# EAGLE design Group_04 (EAGLE 9.6.2)
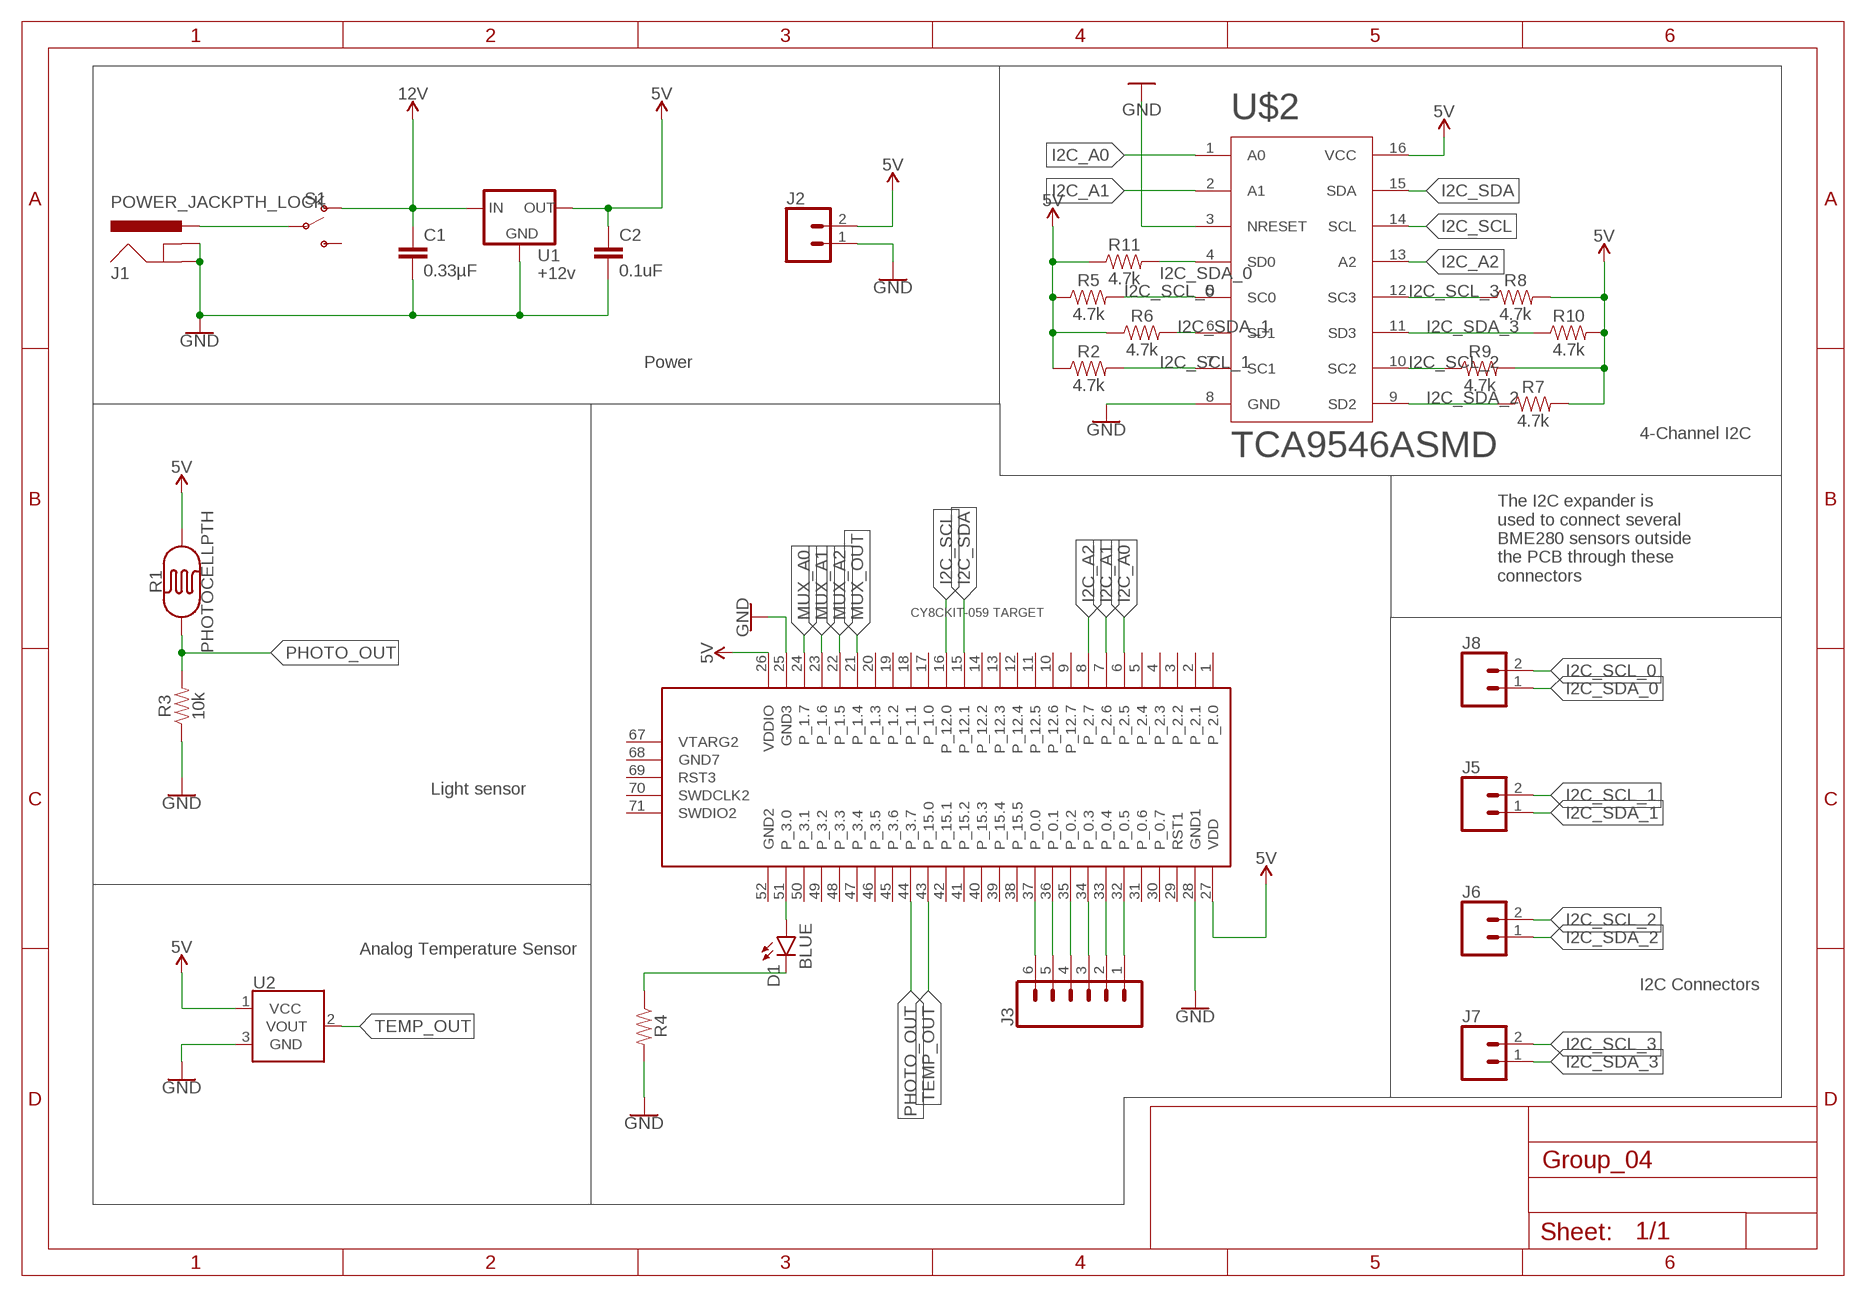
[diagram p0: schematic, sheet 1, part 1 of 2]
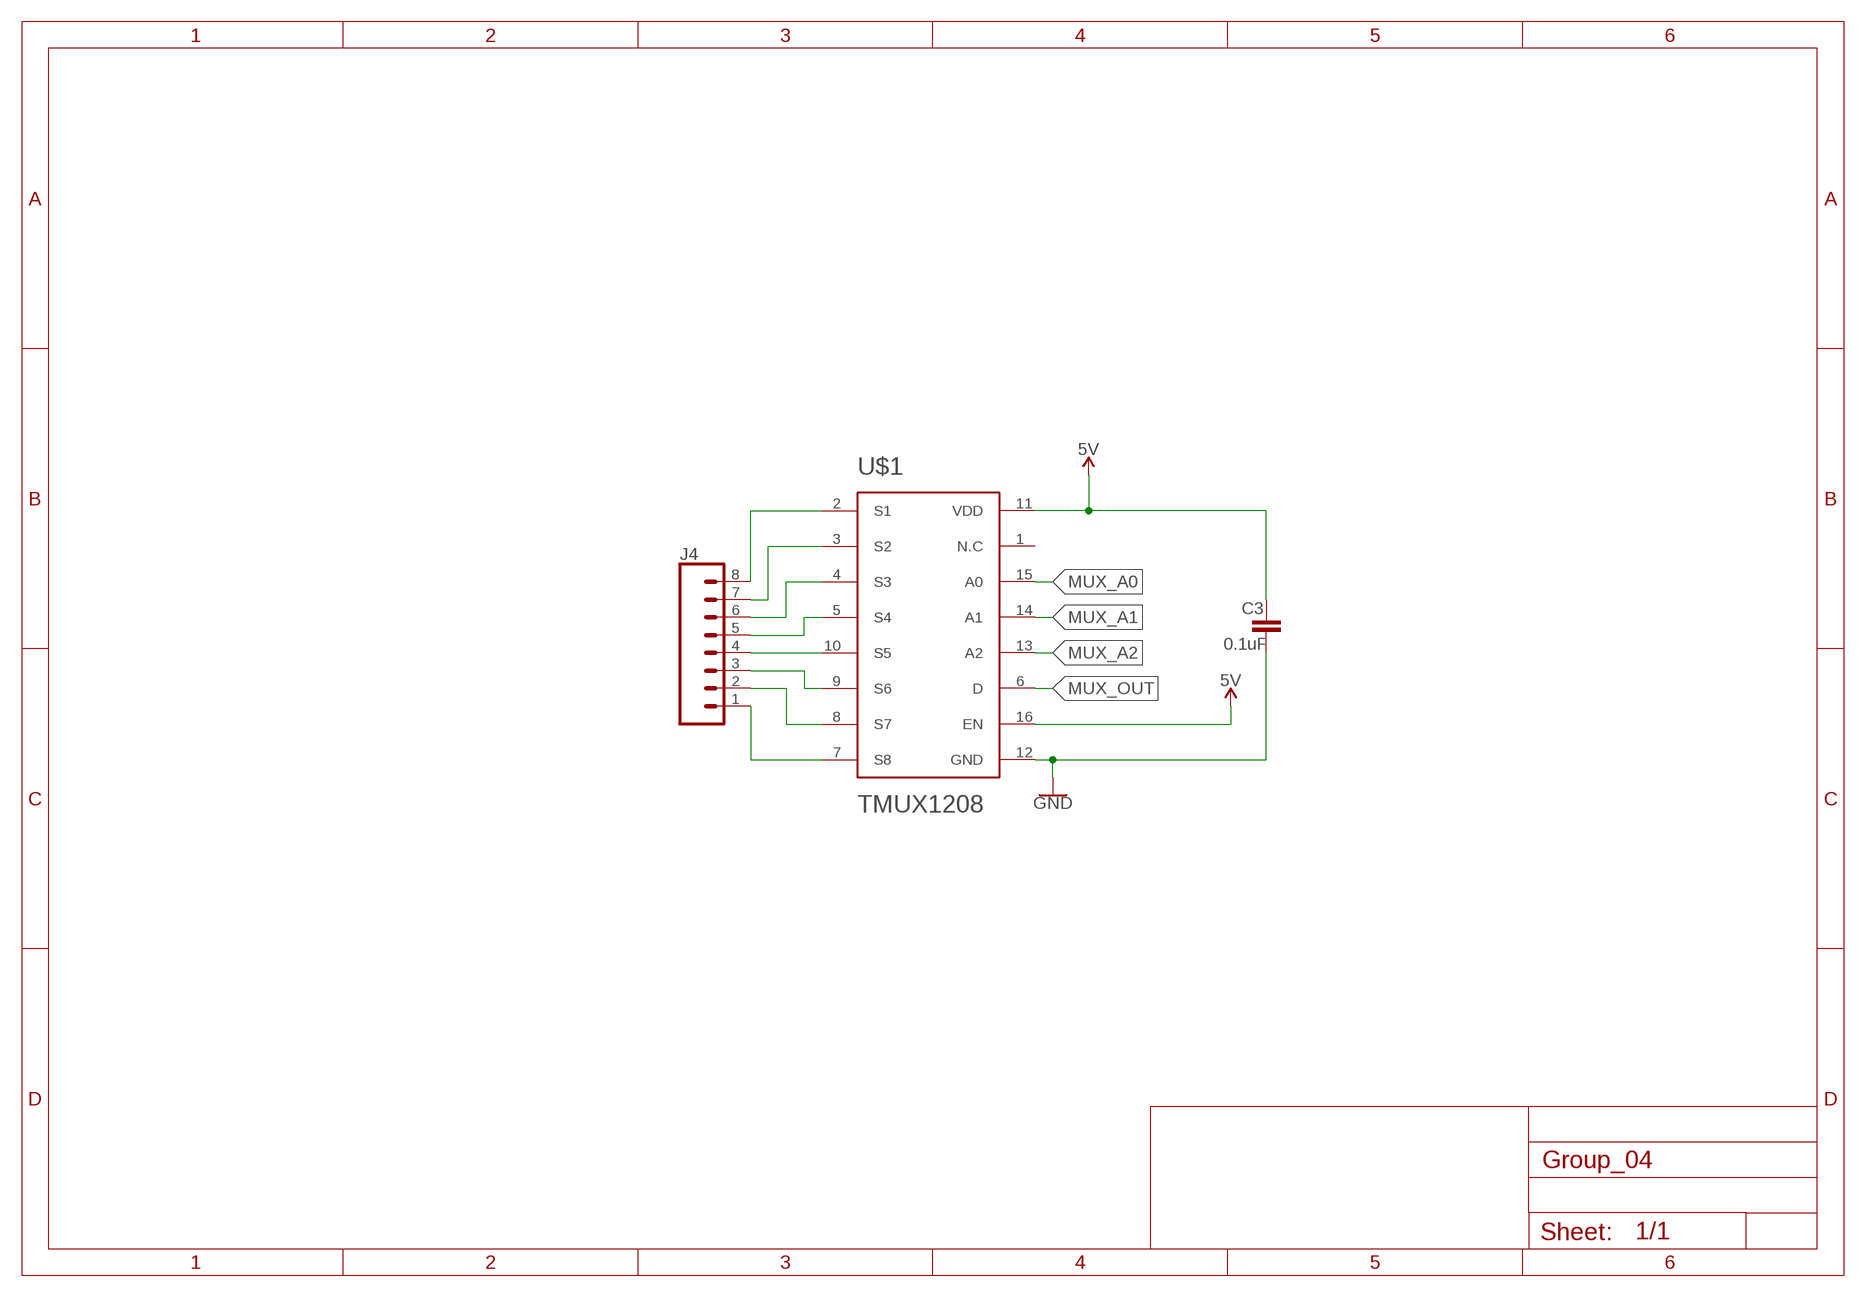
[diagram p1: schematic, sheet 1, part 2 of 2]

## Parts
C1  0.33µF  0.33UF/330NF-0805-50V-10%  [0805]
C2  0.1uF  0.1UF-KIT-EZ-50V-20%  [CAP-PTH-SMALL-KIT]
C3  0.1uF  0.1UF-KIT-EZ-50V-20%  [CAP-PTH-SMALL-KIT]
D1  BLUE  LED-BLUE1206  [LED-1206]
J1  POWER_JACKPTH_LOCK  [POWER_JACK_PTH_LOCK]
J2  CONN_02  [1X02]
J3  CONN_06LOCK  [1X06_LOCK]
J4  CONN_08LOCK  [1X08_LOCK]
J5  CONN_02  [1X02]
J6  CONN_02  [1X02]
J7  CONN_02  [1X02]
J8  CONN_02  [1X02]
R1  PHOTOCELLPTH  [PHOTOCELL]
R2  4.7k  4.7KOHM-0603-1/10W-1%  [0603]
R3  10k  10KOHM-0603-1/10W-1%  [0603]
R4  RESISTORAXIAL-0.3  [AXIAL-0.3]
R5  4.7k  4.7KOHM-0603-1/10W-1%  [0603]
R6  4.7k  4.7KOHM-0603-1/10W-1%  [0603]
R7  4.7k  4.7KOHM-0603-1/10W-1%  [0603]
R8  4.7k  4.7KOHM-0603-1/10W-1%  [0603]
R9  4.7k  4.7KOHM-0603-1/10W-1%  [0603]
R10  4.7k  4.7KOHM-0603-1/10W-1%  [0603]
R11  4.7k  4.7KOHM-0603-1/10W-1%  [0603]
S1  SWITCH-SPDT-PTH-11.6X4.0MM  [SWITCH_SPDT_PTH_11.6X4.0MM]
U1  +12v  V_REG_78XX7812  [TO-252]
U2  TMP36GT9  [TO-92]
U$1  TMUX1208  [QFN-16]
U$2  TCA9546ASMD  [TSSOP-16]
U$3  CY8CKIT-059_TARGET  [CY8CKIT-059_TARGET]

## Nets
5V: C2.1 C3.1 J2.2 R1.2 R2.1 R5.1 R6.1 R7.2 R8.2 R9.2 R10.2 R11.1 U1.2(OUT) U2.1(VCC) U$1.11(VDD) U$1.16(EN) U$2.16(VCC) U$3.26(VDDIO) U$3.27(VDD)
12V: C1.1 S1.1(O) U1.1(IN)
GND: C1.2 C2.2 C3.2 J1.GND J1.GNDBREAK J2.1 R3.1 R4.P$2 U1.3(GND) U2.3(GND) U$1.12(GND) U$2.3(NRESET) U$2.8(GND) U$3.25(GND3) U$3.28(GND1)
I2C_A0: U$2.1(A0) U$3.6(P_2.5)
I2C_A1: U$2.2(A1) U$3.7(P_2.6)
I2C_A2: U$2.13(A2) U$3.8(P_2.7)
I2C_SCL: U$2.14(SCL) U$3.16(P_12.0)
I2C_SCL_0: J8.2 R5.2 U$2.5(SC0)
I2C_SCL_1: J5.2 R2.2 U$2.7(SC1)
I2C_SCL_2: J6.2 R9.1 U$2.10(SC2)
I2C_SCL_3: J7.2 R8.1 U$2.12(SC3)
I2C_SDA: U$2.15(SDA) U$3.15(P_12.1)
I2C_SDA_0: J8.1 R11.2 U$2.4(SD0)
I2C_SDA_1: J5.1 R6.2 U$2.6(SD1)
I2C_SDA_2: J6.1 R7.1 U$2.9(SD2)
I2C_SDA_3: J7.1 R10.1 U$2.11(SD3)
MUX_A0: U$1.15(A0) U$3.24(P_1.7)
MUX_A1: U$1.14(A1) U$3.23(P_1.6)
MUX_A2: U$1.13(A2) U$3.22(P_1.5)
MUX_OUT: U$1.6(D) U$3.21(P_1.4)
N$1: J1.PWR S1.2(P)
N$5: J4.4 U$1.10(S5)
N$10: J4.8 U$1.2(S1)
N$11: J4.7 U$1.3(S2)
N$12: J4.6 U$1.4(S3)
N$13: J4.5 U$1.5(S4)
N$15: J4.3 U$1.9(S6)
N$16: J4.2 U$1.8(S7)
N$17: J4.1 U$1.7(S8)
N$18: D1.C R4.P$1
N$19: D1.A U$3.51(P_3.0)
N$20: J3.6 U$3.37(P_0.0)
N$21: J3.5 U$3.36(P_0.1)
N$22: J3.4 U$3.35(P_0.2)
N$23: J3.3 U$3.34(P_0.3)
N$24: J3.2 U$3.33(P_0.4)
N$25: J3.1 U$3.32(P_0.5)
PHOTO_OUT: R1.1 R3.2 U$3.44(P_3.7)
TEMP_OUT: U2.2(VOUT) U$3.43(P_15.0)
Unconnected: S1.3(S) U$1.1(N.C) U$3.1(P_2.0) U$3.2(P_2.1) U$3.3(P_2.2) U$3.4(P_2.3) U$3.5(P_2.4) U$3.9(P_12.7) U$3.10(P_12.6) U$3.11(P_12.5) U$3.12(P_12.4) U$3.13(P_12.3) U$3.14(P_12.2) U$3.17(P_1.0) U$3.18(P_1.1) U$3.19(P_1.2) U$3.20(P_1.3) U$3.29(RST1) U$3.30(P_0.7) U$3.31(P_0.6) U$3.38(P_15.5) U$3.39(P_15.4) U$3.40(P_15.3) U$3.41(P_15.2) U$3.42(P_15.1) U$3.45(P_3.6) U$3.46(P_3.5) U$3.47(P_3.4) U$3.48(P_3.3) U$3.49(P_3.2) U$3.50(P_3.1) U$3.52(GND2) U$3.67(VTARG2) U$3.68(GND7) U$3.69(RST3) U$3.70(SWDCLK2) U$3.71(SWDIO2)

## Notes on the sheet
- Power
- 4-Channel I2C
- The I2C expander is 
  used to connect several 
  BME280 sensors outside 
  the PCB through these 
  connectors
- Light sensor
- Analog Temperature Sensor
- I2C Connectors

## Library data of the parts
C1 = SparkFun-Capacitors:0.33UF/330NF: 0.33µF/330nF ceramic capacitors A capacitor is a passive two-terminal electrical component used to store electrical energy temporarily in an electric field.; PROD_ID: CAP-08469
C2 C3 = SparkFun-Capacitors:0.1UF: 0.1µF ceramic capacitors A capacitor is a passive two-terminal electrical component used to store electrical energy temporarily in an electric field.; PROD_ID: CAP-08370
D1 = SparkFun-LED:LED-BLUE: Blue SMD LED Used in manufacturing of various products at SparkFun Packages: 0603 - SMD 0603 package [Product Link] <http://www.digikey.com/product-detail/en/SMLE12BC7TT86/511-1589-2-ND/1641808> 1206 - SMD1206 package [Product Link] <http://www.digikey.com/product-detail/en/lite-on-inc/LTST-C150TBKT/160-1643-1-ND/573584> SparkFun Products: ESP8266 Thing-Dev Board <https://www.sparkfun.com/products/13711> RedBoard <https://www.sparkfun.com/products/12757>; PROD_ID: DIO-09911
J1 = SparkFun-Connectors:POWER_JACK: Power Jack Connector This is the standard 5.5mm barrel jack for power. The PTH is the most common, proven, reliable, footprint. The Slot footprint only works if the mill layer is transmitted to the PCB fab house so be warned. Here are the connectors we sell at SparkFun: DC Barrel Power Jack/Connector <https://www.sparkfun.com/products/119> (PRT-00119) DC Barrel Power Jack/Connector (SMD) <https://www.sparkfun.com/products/12748> (PRT-12748) DC Barrel Jack Adapter - Breadboard Compatible <https://www.sparkfun.com/products/10811> (PRT-10811) It is used on this SparkFun product (and many, many others): SparkFun RedBoard - Programmed with Arduino <https://www.sparkfun.com/products/12757> (DEV-12757) Also, if you need a mating power supply or connector, please check these out: Wall Adapter Power Supply - 9VDC 650mA <https://www.sparkfun.com/products/298> (TOL-00298) DC Barrel Jack Adapter - Male <https://www.sparkfun.com/products/10287> (PRT-10287); PROD_ID: CONN-08197; SF_ID: PRT-00119
J2 J5-J8 = SparkFun-Connectors:CONN_02: Multi connection point. Often used as Generic Header-pin footprint for 0.1 inch spaced/style header connections On any of the 0.1 inch spaced packages, you can populate with these: Break Away Headers - Straight <https://www.sparkfun.com/products/116> (PRT-00116) Break Away Male Headers - Right Angle <https://www.sparkfun.com/products/553> (PRT-00553) Female Headers <https://www.sparkfun.com/products/115> (PRT-00115) Break Away Headers - Machine Pin <https://www.sparkfun.com/products/117> (PRT-00117) Break Away Female Headers - Swiss Machine Pin <https://www.sparkfun.com/products/743> (PRT-00743) For SCREWTERMINALS and SPRING TERMINALS visit here: Screw Terimnals on SparkFun.com <https://www.sparkfun.com/search/results?term=Screw+Terminals> (5mm/3.5mm/2.54mm spacing) This device is also useful as a general connection point to wire up your design to another part of your project. Our various solder wires solder well into these plated through hole pads. Hook-Up Wire - Assortment (Stranded, 22 AWG) <https://www.sparkfun.com/products/11375> (PRT-11375) Hook-Up Wire - Assortment (Solid Core, 22 AWG) <https://www.sparkfun.com/products/11367> (PRT-11367) View the entire wire category on our website here <https://www.sparkfun.com/categories/141> Special notes: Molex polarized connector foot print use with: PRT-08233 with associated crimp pins and housings. 2.54_SCREWTERM for use with PRT-10571. 3.5mm Screw Terminal footprints for PRT-08084 5mm Screw Terminal footprints for use with PRT-08432
J3 = SparkFun-Connectors:CONN_06: Multi connection point. Often used as Generic Header-pin footprint for 0.1 inch spaced/style header connections On any of the 0.1 inch spaced packages, you can populate with these: Break Away Headers - Straight <https://www.sparkfun.com/products/116> (PRT-00116) Break Away Male Headers - Right Angle <https://www.sparkfun.com/products/553> (PRT-00553) Female Headers <https://www.sparkfun.com/products/115> (PRT-00115) Break Away Headers - Machine Pin <https://www.sparkfun.com/products/117> (PRT-00117) Break Away Female Headers - Swiss Machine Pin <https://www.sparkfun.com/products/743> (PRT-00743) Arduino Stackable Header - 6 Pin <https://www.sparkfun.com/products/9280> (PRT-09280) For SCREWTERMINALS and SPRING TERMINALS visit here: Screw Terimnals on SparkFun.com <https://www.sparkfun.com/search/results?term=Screw+Terminals> (5mm/3.5mm/2.54mm spacing) This device is also useful as a general connection point to wire up your design to another part of your project. Our various solder wires solder well into these plated through hole pads. Hook-Up Wire - Assortment (Stranded, 22 AWG) <https://www.sparkfun.com/products/11375> (PRT-11375) Hook-Up Wire - Assortment (Solid Core, 22 AWG) <https://www.sparkfun.com/products/11367> (PRT-11367) View the entire wire category on our website here <https://www.sparkfun.com/categories/141>
J4 = SparkFun-Connectors:CONN_08: Multi connection point. Often used as Generic Header-pin footprint for 0.1 inch spaced/style header connections On any of the 0.1 inch spaced packages, you can populate with these: Break Away Headers - Straight <https://www.sparkfun.com/products/116> (PRT-00116) Break Away Male Headers - Right Angle <https://www.sparkfun.com/products/553> (PRT-00553) Female Headers <https://www.sparkfun.com/products/115> (PRT-00115) Break Away Headers - Machine Pin <https://www.sparkfun.com/products/117> (PRT-00117) Break Away Female Headers - Swiss Machine Pin <https://www.sparkfun.com/products/743> (PRT-00743) Arduino Stackable Header - 8 Pin <https://www.sparkfun.com/products/9279> (PRT-09279) For SCREWTERMINALS and SPRING TERMINALS visit here: Screw Terimnals on SparkFun.com <https://www.sparkfun.com/search/results?term=Screw+Terminals> (5mm/3.5mm/2.54mm spacing) This device is also useful as a general connection point to wire up your design to another part of your project. Our various solder wires solder well into these plated through hole pads. Hook-Up Wire - Assortment (Stranded, 22 AWG) <https://www.sparkfun.com/products/11375> (PRT-11375) Hook-Up Wire - Assortment (Solid Core, 22 AWG) <https://www.sparkfun.com/products/11367> (PRT-11367) View the entire wire category on our website here <https://www.sparkfun.com/categories/141> Special notes: Molex polarized connector foot print use with SKU : PRT-08231 with associated crimp pins and housings. 1MM SMD Version SKU: PRT-10208 NOTES ON THE VARIANTS LOCK and LOCK_LONGPADS... This footprint was designed to help hold the alignment of a through-hole component (i.e. 6-pin header) while soldering it into place. You may notice that each hole has been shifted either up or down by 0.005 of an inch from it's more standard position (which is a perfectly straight line). This slight alteration caused the pins (the squares in the middle) to touch the edges of the holes. Because they are alternating, it causes a "brace" to hold the component in place. 0.005 has proven to be the perfect amount of "off-center" position when using our standard breakaway headers. Although looks a little odd when you look at the bare footprint, once you have a header in there, the alteration is very hard to notice. Also,if you push a header all the way into place, it is covered up entirely on the bottom side.
R1 = SparkFun-Sensors:PHOTOCELL: Photocell (Photodetector, Photo Resistor, CdS) This is a very small light sensor. A photocell changes (also called a photodetector, photo resistor, CdS or photoconductive cell) resistance depending on the amount of light it is exposed to. These little sensors make great ambient light triggers (when light in the room turns on, do something). Datasheet <http://cdn.sparkfun.com/datasheets/Sensors/LightImaging/SEN-09088.pdf> SparkFun Products Mini Photocell <https://www.sparkfun.com/products/9088> (SEN-09088); PROD_ID: COMP-09129; SF_ID: SEN-09088
R2 R5-R11 = SparkFun-Resistors:4.7KOHM: 4.7kΩ resistor A resistor is a passive two-terminal electrical component that implements electrical resistance as a circuit element. Resistors act to reduce current flow, and, at the same time, act to lower voltage levels within circuits. - Wikipedia; PROD_ID: RES-07857
R3 = SparkFun-Resistors:10KOHM: 10kΩ resistor A resistor is a passive two-terminal electrical component that implements electrical resistance as a circuit element. Resistors act to reduce current flow, and, at the same time, act to lower voltage levels within circuits. - Wikipedia; PROD_ID: RES-00824
R4 = SparkFun-Resistors:RESISTOR: Generic Resistor Package
S1 = SparkFun-Switches:SWITCH-SPDT: Single Pole, Double Throw (SPDT) Switch Single-pole, double-throw (SPDT) switch. Variant Overview SMD-AYZ0202 Surface Mount DPDT Switch <https://www.sparkfun.com/products/597> (COM-00597) Used on e.g. LilyPad Arduino USB - ATmega32U4 Board <https://www.sparkfun.com/products/12049> PTH-11.6X4.0MM SPDT Mini Power Switch <https://www.sparkfun.com/products/102> (COM-00102) Used on e.g. SparkFun Simon Says - Through-Hole Soldering Kit <https://www.sparkfun.com/products/10547> (KIT-10547) PTH-11.6X4.0MM-KIT KIT version of SPDT Mini Power Switch - Simplifies soldering by removing tStop of switch pins - only one side can be soldered. PTH-11.6X4.0MM-LOCK LOCK version of SPDT Mini Power Switch - Offset pins hold switch in place for easier soldering. SMD-RIGHT-ANGLE Surface Mount Right Angle Switch <https://www.sparkfun.com/products/10860> (COM-10860) Used on e.g. SparkFun ESP8266 Thing <https://www.sparkfun.com/products/13231>; PROD_ID: SWCH-08261; SF_SKU: COM-00102
U1 = SparkFun-IC-Power:V_REG_78XX: Voltage Regulator Standard 78xx regulator. IGO (Input Ground Output). Spark Fun Electronics SKU : COM-00107; PROD_ID: VREG-12370
U2 = SparkFun-Sensors:TMP36: TMP36 Precision Analog °C Temperature Sensor The TMP36 is a low voltage, precision centigrade temperature sensor. It provides a voltage output that is linearly proportional to the Celsius temperature. It also doesn’t require any external calibration to provide typical accuracies of ±1°C at +25°C and ±2°C over the −40°C to +125°C temperature range. We like it because it’s so easy to use: Just give the device a ground and 2.7 to 5.5 VDC and read the voltage on the Vout pin. The output voltage can be converted to temperature easily using the scale factor of 10 mV/°C. Datasheet <http://cdn.sparkfun.com/datasheets/Sensors/Temp/TMP35_36_37.pdf> SparkFun Products Temperature Sensor - TMP36 <https://www.sparkfun.com/products/10988> (SEN-10988) SparkFun Danger Shield <https://www.sparkfun.com/products/11649> (DEV-11649); PROD_ID: IC-09880; SF_ID: SEN-10988
U$1 = Group_04_Library:TMUX1208: TMUX1208 The TMUX1208 and TMUX1209 are general purpose complementary metal-oxide semiconductor (CMOS) multiplexers (MUX). The TMUX1208 offers 8:1 single ended channels, while the TMUX1209 offers differential 4:1 or dual 4:1 single-ended channels. Wide operating supply of 1.08 V to 5.5 V allows for use in a broad array of applications from personal electronics to building automation applications. The device supports bidirectional analog and digital signals on the source (Sx) and drain (D) pins ranging from GND to VDD.
U$2 = mylibrary_1:TCA9546A: TCA9546A The TCA9546A is a quad bidirectional translating switch controlled via the I 2C bus. The SCL/SDA upstream pair fans out to four downstream pairs, or channels. Any individual SCn/SDn channel or combination of channels can be selected, determined by the contents of the programmable control register. An active-low reset (RESET) input allows the TCA9546A to recover from a situation in which one of the downstream I 2C buses is stuck in a low state. Pulling RESET low resets the I 2C state machine and causes all the channels to be deselected, as does the internal power-on reset function. The pass gates of the switches are constructed such that the VCC pin can be used to limit the maximum high voltage, which will be passed by the TCA9546A. This allows the use of different bus voltages on each pair, so that 1.8-V, 2.5-V, or 3.3-V parts can communicate with 5-V parts without any additional protection. External pull-up resistors pull the bus up to the desired voltage level for each channel. All I/O pins are 5.5-V tolerant. Available packages: TSSOP-16 SOIC-16
U$3 = CY8KIT-059:CY8CKIT-059_TARGET: CY8CKIT-059 Target This device exposes the pins of the target section of the CY8CKIT-059, including the programming section, that must be connected to the KitProg in order to program the target micro-controller.

## Board
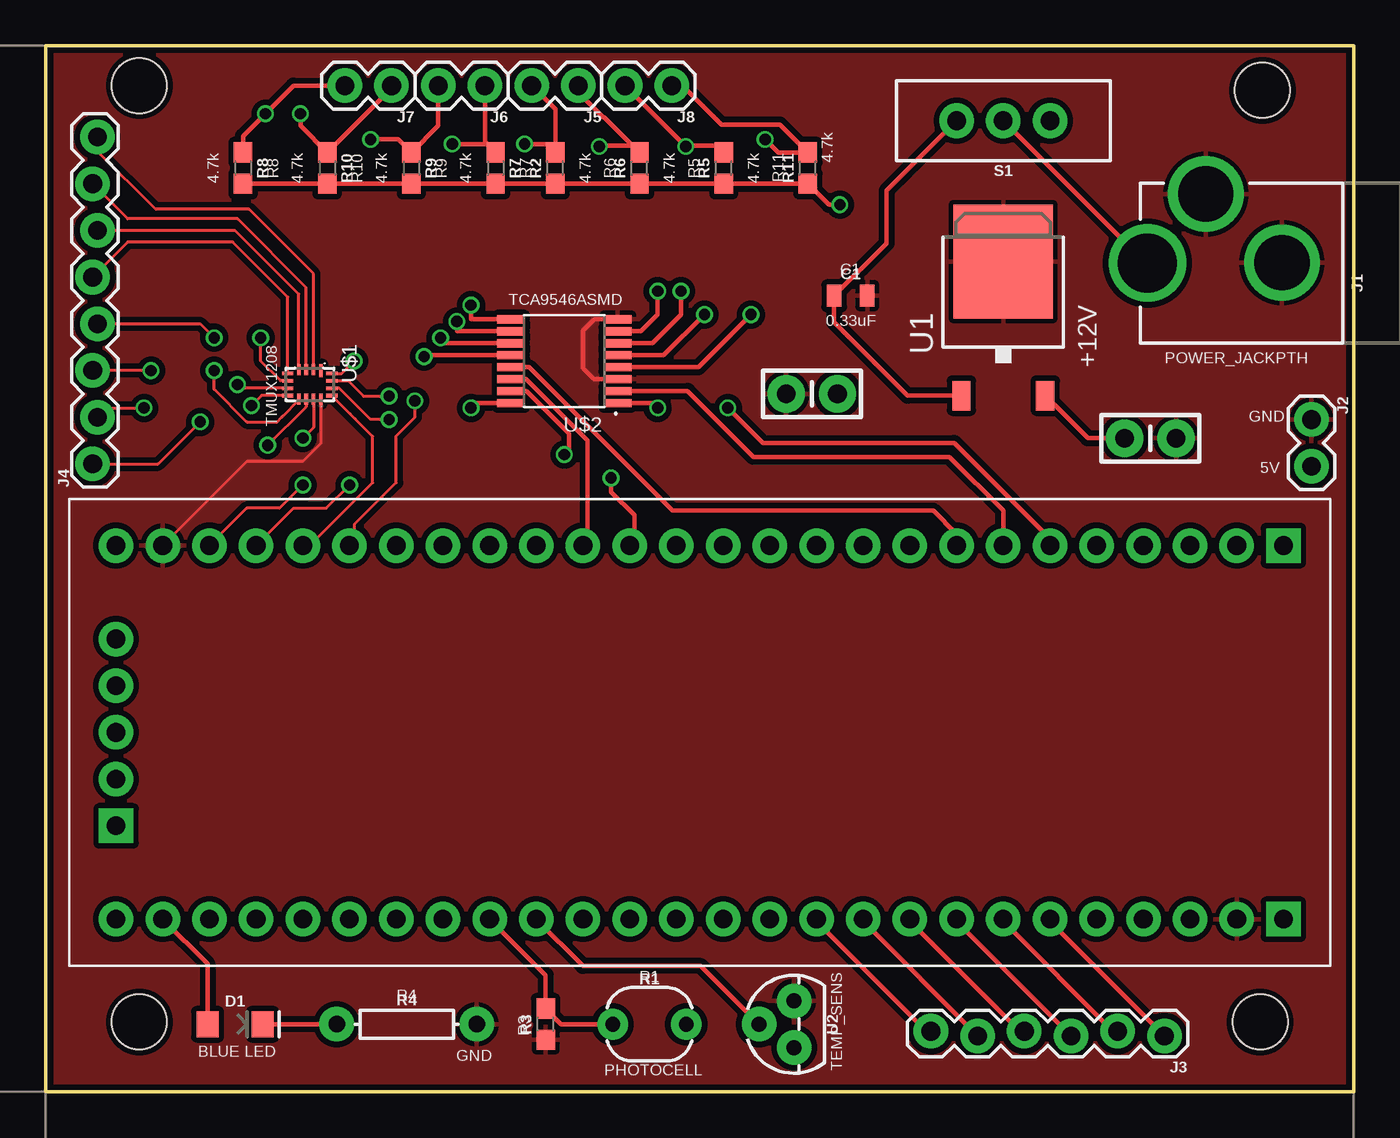
[diagram p2: board, top side]
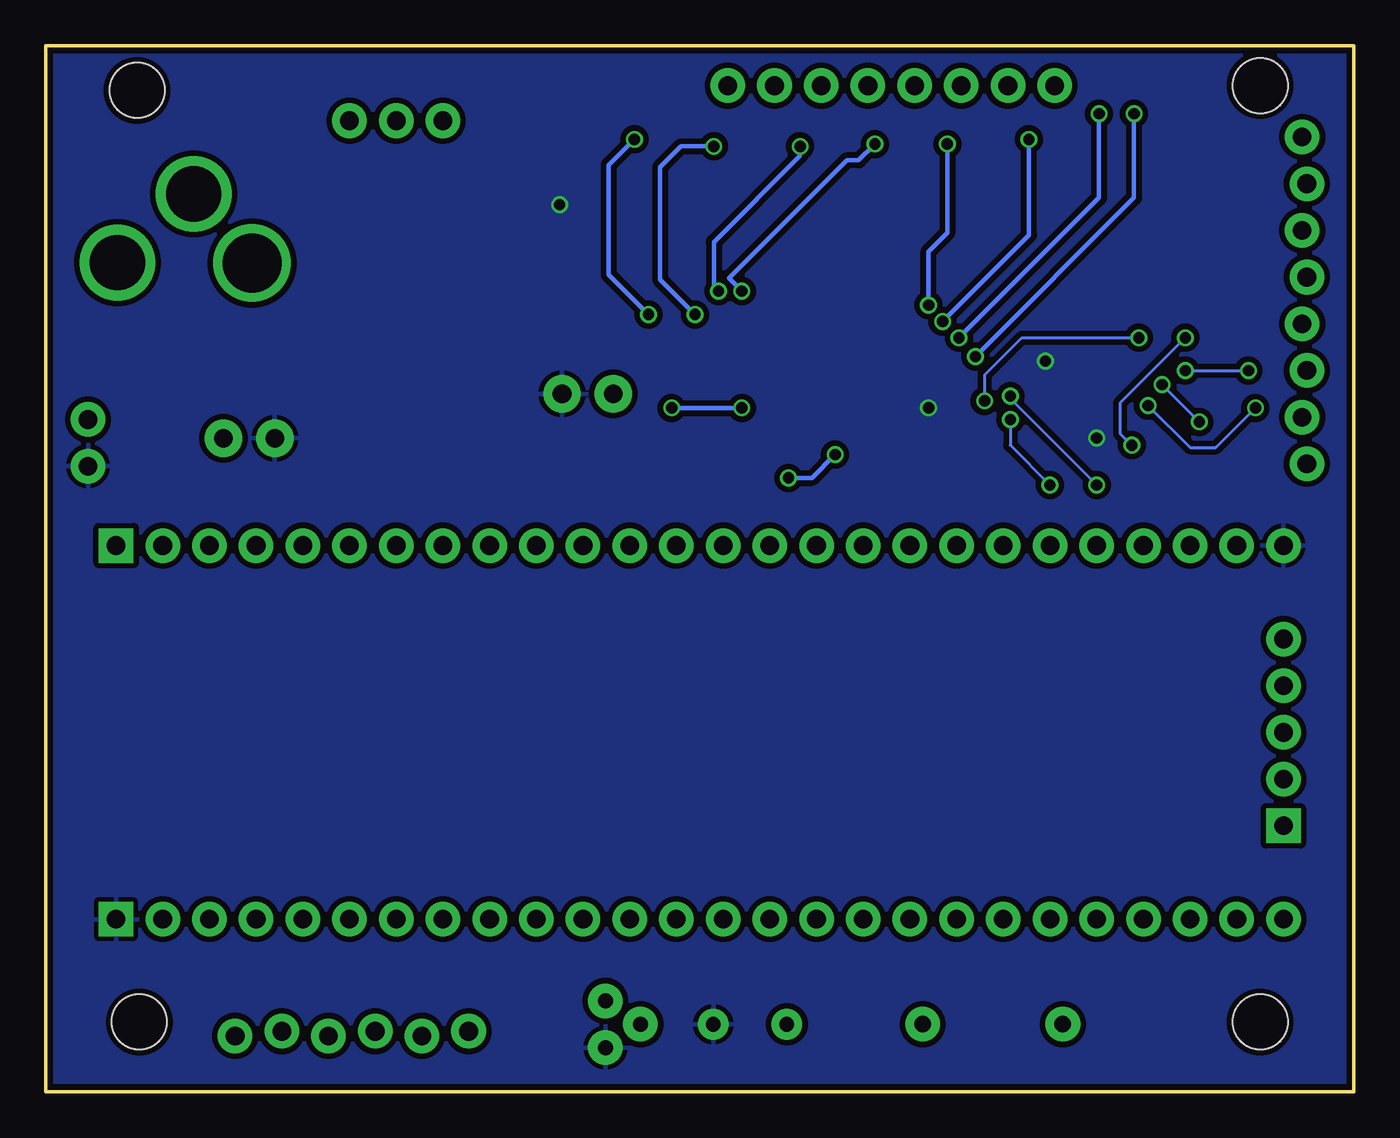
[diagram p3: board, bottom side, seen from below]

Size 71.12 x 56.9 mm. Coordinates in mm from the lower left corner, seen from the top.
Outline: 0,0 71.12,0 71.12,56.9 0,56.9 0,0
Copper layers (1*16): Top 0.035mm / dielectric 1.5mm / Bottom 0.035mm
Design rules "Group_04": minimum track width 6mil, minimum drill 8mil, track to track 6mil, track to pad 6mil, pad to pad 6mil, via to via 6mil, smd to smd 6mil, copper to edge 8mil, drill to drill 22mil, minimum pad ring 8mil, minimum via ring 6mil, stop-mask expansion 8mil, vias tented up to drill 0mil, thermal gap 10mil
Holes 3 mm at 5.08,3.81 66.04,3.81 66.17,54.48 5.08,54.74

### Footprints (pad centres in the part's own frame; a part is rotated, then mirrored left to right if it is on the bottom)
0805 = smd 0.8 x 1.2: 1 -0.9,0; 2 0.9,0
CAP-PTH-SMALL-KIT = drill 1.016 pad 2.032: 1 -1.397,0; 2 1.397,0
LED-1206 = smd 1.2 x 1.4: A -1.5,0; C 1.5,0
POWER_JACK_PTH_LOCK = drill 2.997 pad 4.115: GND 0.025,6.557; GNDBREAK 3.762,10.7 | drill 3.2 pad 4.115: PWR 0,13.878
1X02 = drill 1.016 pad 1.88: 1 0,0; 2 2.54,0
1X06_LOCK = drill 1.016 pad 1.88: 1 0,0; 2 2.54,-0.254; 3 5.08,0; 4 7.62,-0.254; 5 10.16,0; 6 12.7,-0.254
1X08_LOCK = drill 1.016 pad 1.88: 1 0,0.127; 2 2.54,-0.127; 3 5.08,0.127; 4 7.62,-0.127; 5 10.16,0.127; 6 12.7,-0.127; 7 15.24,0.127; 8 17.78,-0.127
PHOTOCELL = drill 0.8 pad 1.676: 1 -2,0; 2 2,0
0603 = smd 1.1 x 1: 1 -0.85,0; 2 0.85,0
AXIAL-0.3 = drill 0.9 pad 1.88: P$1 -3.81,0; P$2 3.81,0
SWITCH_SPDT_PTH_11.6X4.0MM = drill 1.016 pad 1.88: 1 0,2.54; 2 0,0; 3 0,-2.54
TO-252 = smd 1 x 1.6: 1 -2.28,-4.8; 2 2.28,-4.8 | smd 5.4 x 6.2: 3 0,2.5
TO-92 = drill 0.813 pad 1.88: 1 -1.27,0; 2 0,1.905; 3 1.27,0
QFN-16 = smd 0.7 x 0.2: 1 -0.75,0.6 | smd 0.6 x 0.2: 2 -0.8,0.2; 3 -0.8,-0.2; 4 -0.8,-0.6; 9 0.8,-0.6; 10 0.8,-0.2; 11 0.8,0.2; 12 0.8,0.6 | smd 0.2 x 0.6: 5 -0.6,-1.2; 6 -0.2,-1.2; 7 0.2,-1.2; 8 0.6,-1.2; 13 0.6,1.2; 14 0.2,1.2; 15 -0.2,1.2; 16 -0.6,1.2
TSSOP-16 = smd 1.5 x 0.45: 1 -2.9,2.275; 2 -2.9,1.625; 3 -2.9,0.975; 4 -2.9,0.325; 5 -2.9,-0.325; 6 -2.9,-0.975; 7 -2.9,-1.625; 8 -2.9,-2.275; 9 2.9,-2.275; 10 2.9,-1.625; 11 2.9,-0.975; 12 2.9,-0.325; 13 2.9,0.325; 14 2.9,0.975; 15 2.9,1.625; 16 2.9,2.275
CY8CKIT-059_TARGET = drill 1.016 pad 1.876 square: 1 30.48,8.89; 27 30.48,-11.43; 71 -33.02,-6.35 | drill 1.016 pad 1.876: 2 27.94,8.89; 3 25.4,8.89; 4 22.86,8.89; 5 20.32,8.89; 6 17.78,8.89; 7 15.24,8.89; 8 12.7,8.89; 9 10.16,8.89; 10 7.62,8.89; 11 5.08,8.89; 12 2.54,8.89; 13 0,8.89; 14 -2.54,8.89; 15 -5.08,8.89; 16 -7.62,8.89; 17 -10.16,8.89; 18 -12.7,8.89; 19 -15.24,8.89; 20 -17.78,8.89; 21 -20.32,8.89; 22 -22.86,8.89; 23 -25.4,8.89; 24 -27.94,8.89; 25 -30.48,8.89; 26 -33.02,8.89; 28 27.94,-11.43; 29 25.4,-11.43; 30 22.86,-11.43; 31 20.32,-11.43; 32 17.78,-11.43; 33 15.24,-11.43; 34 12.7,-11.43; 35 10.16,-11.43; 36 7.62,-11.43; 37 5.08,-11.43; 38 2.54,-11.43; 39 0,-11.43; 40 -2.54,-11.43; 41 -5.08,-11.43; 42 -7.62,-11.43; 43 -10.16,-11.43; 44 -12.7,-11.43; 45 -15.24,-11.43; 46 -17.78,-11.43; 47 -20.32,-11.43; 48 -22.86,-11.43; 49 -25.4,-11.43; 50 -27.94,-11.43; 51 -30.48,-11.43; 52 -33.02,-11.43; 67 -33.02,3.81; 68 -33.02,1.27; 69 -33.02,-1.27; 70 -33.02,-3.81

### Placement (x,y rotation side)
C1  43.77,43.31 0 top
C2  41.66,37.97 180 top
C3  60.07,35.56 0 top
D1  10.29,3.68 0 top
J1  73.79,45.09 90 top
J2  68.83,36.58 270 top
J3  60.83,3.05 180 top
J4  2.67,34.16 90 top
J5  28.96,54.74 180 top
J6  23.88,54.74 180 top
J7  18.8,54.74 180 top
J8  34.04,54.74 180 top
R1  32.83,3.68 0 top
R2  27.7,50.25 90 top
R3  27.18,3.68 90 top
R4  19.62,3.68 0 top
R5  36.86,50.25 90 top
R6  32.28,50.25 90 top
R7  24.46,50.25 270 top
R8  10.72,50.25 270 top
R9  19.88,50.25 270 top
R10  15.3,50.25 270 top
R11  41.44,50.25 90 top
S1  52.07,52.83 90 top
U1  52.07,42.67 0 top
U2  40.69,3.68 90 top
U$1  14.35,38.48 270 top
U$2  28.19,39.75 180 top
U$3  36.83,20.83 0 top

### Tracks (layer width: path | path; a pad name or v marks a point on that pad's centre or on a via)
5V  (via drill 0.6, 0.61)
  Top 0.152: U$1.16 16.09,39.08 v16.76,39.75 | v13.97,35.56 14.55,36.14 U$1.11
  Top 0.254: R8.2 R10.2 R9.2 R7.2 R2.1 R6.1 R5.1 R11.1 42.58,48.26 v43.18,48.26 | U1.2 56.66,35.56 C3.1 | U$2.16 23.38,37.48 v23.11,37.21
  pour Bottom (isolate 0.305): 0,56.9 0,0 71.12,0 71.12,56.9
12V
  Top 0.254: U1.1 46.87,37.87 42.87,41.87 C1.1 45.72,46.15 45.72,49.02 S1.1
GND
  Top 0.152: U$1.12 14.95,35.27 13.97,34.29 10.92,34.29 U$3.25
  Top 0.254: U$2.3 29.8,38.78 29.21,39.37 29.21,41.4 29.83,42.03 U$2.8
  pour Top (isolate 0.305): 0,56.9 0,0 71.12,0 71.12,56.9
I2C_A0  (via drill 0.61)
  Top 0.254: v37.08,37.21 38.99,35.31 49.4,35.31 54.61,30.1 U$3.6 | U$2.1 33.01,37.48 v33.27,37.21
  Bottom 0.254: v37.08,37.21 v33.27,37.21
I2C_A1
  Top 0.254: U$2.2 34.9,38.13 38.48,34.54 49.15,34.54 52.07,31.62 U$3.7
I2C_A2
  Top 0.254: U$2.13 26.27,39.43 34.08,31.62 48.26,31.62 49.53,30.35 U$3.8
I2C_SCL
  Top 0.254: U$2.14 26.12,38.78 29.46,35.43 29.46,29.97 U$3.16
I2C_SCL_0  (via drill 0.61)
  Top 0.254: U$2.5 33.6,40.08 v35.81,42.29 | R5.2 36.48,51.48 34.84,51.48 v34.8,51.44 J8.2
  Bottom 0.254: v34.8,51.44 36.58,51.44 37.72,50.29 37.72,44.2 v35.81,42.29
I2C_SCL_1  (via drill 0.61)
  Top 0.254: J5.2 27.7,53.45 R2.2 27.24,51.56 v26.04,51.56 | U$2.7 32.36,41.38 33.27,42.29 v33.27,43.56
  Bottom 0.254: v33.27,43.56 33.97,44.26 27.56,50.67 26.92,50.67 v26.04,51.56
I2C_SCL_2  (via drill 0.61)
  Top 0.254: J6.2 21.34,52.56 R9.1 19.16,51.82 v17.65,51.82 | U$2.10 22.35,41.38 v22.35,41.91
  Bottom 0.254: v22.35,41.91 17.65,46.61 v17.65,51.82
I2C_SCL_3  (via drill 0.61)
  Top 0.254: U$2.12 20.5,40.08 v20.57,40.01 | R8.1 10.72,51.99 v11.94,53.21 13.46,54.74 J7.2
  Bottom 0.254: v11.94,53.21 11.94,48.64 v20.57,40.01
I2C_SDA  (via drill 0.61)
  Top 0.254: U$2.15 26.14,38.13 28.45,35.81 28.45,34.92 v28.19,34.67 | v30.73,33.4 30.73,32.64 32,31.37 32,29.97 U$3.15
  Bottom 0.254: v30.73,33.4 29.46,33.4 v28.19,34.67
I2C_SDA_0  (via drill 0.61)
  Top 0.254: J8.1 34.63,54.74 36.74,52.62 39.92,52.62 R11.2 39.83,51.1 v39.12,51.82 | U$2.4 35.49,39.43 v38.35,42.29
  Bottom 0.254: v39.12,51.82 40.51,50.42 40.51,44.45 v38.35,42.29
I2C_SDA_1  (via drill 0.61)
  Top 0.254: J5.1 28.96,54.36 30.29,53.02 30.36,53.02 R6.2 31.9,51.48 30.14,51.48 v30.1,51.44 | U$2.6 32.98,40.73 34.54,42.29 v34.54,43.56
  Bottom 0.254: v34.54,43.56 34.8,43.81 34.8,46.23 30.1,50.93 v30.1,51.44
I2C_SDA_2  (via drill 0.61)
  Top 0.254: J6.1 23.88,51.68 R7.1 23.99,51.56 v22.1,51.56 | U$2.9 23.14,42.03 23.14,42.82 v23.11,42.8
  Bottom 0.254: v22.1,51.56 22.1,46.74 23.11,45.72 v23.11,42.8
I2C_SDA_3  (via drill 0.61)
  Top 0.254: J7.1 18.8,54.6 R10.1 13.84,52.55 v13.84,53.21 | U$2.11 21.46,40.73 v21.46,41.02
  Bottom 0.254: v13.84,53.21 13.84,48.64 v21.46,41.02
MUX_A0  (via drill 0.61)
  Top 0.152: U$1.15 16.44,38.68 17.27,37.85 v18.67,37.85 | v13.97,33.02 12.7,31.75 10.92,31.75 U$3.24
  Bottom 0.152: v18.67,37.85 18.67,37.72 v13.97,33.02
MUX_A1  (via drill 0.61)
  Top 0.152: U$1.14 15.95,38.28 17.65,36.58 v18.67,36.58 | U$3.23 13.46,31.75 15.24,31.75 v16.51,33.02
  Bottom 0.152: v18.67,36.58 18.67,35.18 v16.51,33.02
MUX_A2
  Top 0.152: U$1.13 16.56,36.88 16.82,36.61 17.78,35.65 17.78,33.15 14.35,29.72 U$3.22
MUX_OUT  (via drill 0.61)
  Top 0.152: U$3.21 16.76,29.97 16.76,30.86 19.05,33.15 19.05,35.69 20.07,36.7 v20.07,37.59 | U$1.6 12.75,38.68 11.68,39.75 v11.68,41.02
  Bottom 0.152: v11.68,41.02 18.03,41.02 20.07,38.99 v20.07,37.59
N$1
  Top 0.254: J1.PWR 59.82,45.09 S1.2
N$5  (via drill 0.61)
  Top 0.152: J4.4 8.38,41.78 v9.14,41.02 | U$1.10 14.15,37.27 v12.06,35.18
  Bottom 0.152: v9.14,41.02 12.7,37.47 12.7,35.81 v12.06,35.18
N$10
  Top 0.152: U$1.2 14.55,44.5 11.05,48.01 5.97,48.01 2.79,51.18 J4.8
N$11
  Top 0.152: J4.7 4.45,47.5 10.41,47.5 14.15,43.76 U$1.3
N$12
  Top 0.152: U$1.4 13.75,43.4 10.29,46.86 J4.6
N$13
  Top 0.152: U$1.5 13.15,43.24 10.16,46.23 4.45,46.23 J4.5
N$15  (via drill 0.61)
  Top 0.152: v9.14,39.24 9.14,38.23 10.92,36.45 12.57,36.45 12.83,36.7 12.9,36.78 13.75,37.63 U$1.9 | v5.71,39.24 J4.3
  Bottom 0.152: v9.14,39.24 v5.71,39.24
N$16  (via drill 0.61)
  Top 0.152: J4.2 3.3,37.21 v5.33,37.21 | U$1.8 11.72,37.88 v11.18,37.34
  Bottom 0.152: v11.18,37.34 8.89,35.05 7.49,35.05 v5.33,37.21
N$17  (via drill 0.61)
  Top 0.152: 2.79,34.16 6.1,34.16 v8.38,36.45 | v10.41,38.48 10.61,38.28 U$1.7
  Top 0.254: 2.79,34.16 J4.1
  Bottom 0.152: v10.41,38.48 v8.38,36.45
N$18
  Top 0.254: R4.P$1 D1.C
N$19
  Top 0.254: U$3.51 8.79,6.96 D1.A
N$20
  Top 0.254: J3.6 47.88,3.3 41.91,9.27 U$3.37
N$21
  Top 0.254: J3.5 44.45,9.27 U$3.36
N$22
  Top 0.254: J3.4 52.96,3.3 46.99,9.27 U$3.35
N$23
  Top 0.254: J3.3 49.53,9.27 U$3.34
N$24
  Top 0.254: J3.2 58.04,3.3 52.07,9.27 U$3.33
N$25
  Top 0.254: J3.1 54.61,9.27 U$3.32
PHOTO_OUT
  Top 0.254: U$3.44 27.18,6.35 R3.2 28.03,3.68 R1.1
TEMP_OUT
  Top 0.254: U2.2 35.61,6.86 29.21,6.86 U$3.43

### Text on the board
tPlace: 4.7k | R8 | R9 | R7 | R6 | R5 | 4.7k | 4.7k | R10 | 4.7k | 4.7k | 4.7k | 4.7k | 4.7k | R11 | C1 | TCA9546ASMD | +12V | 0.33uF | POWER_JACKPTH | 5V | GND | TMUX1208 | GND | 5V | R1 | R4 | R3 | BLUE LED | GND | PHOTOCELL | TEMP_SENS